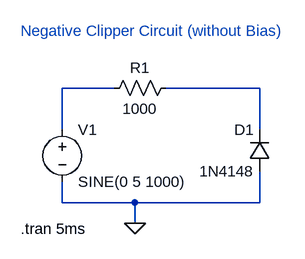
[diagram p0: schematic Assignment 1b (i).asc]
Assignment 1b (i).asc, the LTspice schematic file:
Version 4.1
SHEET 1 880 680
WIRE 176 64 96 64
WIRE 400 64 256 64
WIRE 96 128 96 64
WIRE 400 128 400 64
WIRE 96 240 96 208
WIRE 208 240 96 240
WIRE 400 240 400 192
WIRE 400 240 208 240
WIRE 208 272 208 240
FLAG 208 272 0
SYMBOL voltage 96 112 R0
WINDOW 123 0 0 Left 0
WINDOW 39 0 0 Left 0
SYMATTR InstName V1
SYMATTR Value SINE(0 5 1000)
SYMBOL res 272 48 R90
WINDOW 0 0 56 VBottom 2
WINDOW 3 32 56 VTop 2
SYMATTR InstName R1
SYMATTR Value 1000
SYMBOL diode 416 192 R180
WINDOW 0 24 64 Left 2
WINDOW 3 24 0 Left 2
SYMATTR InstName D1
SYMATTR Value 1N4148
TEXT 32 280 Left 2 !.tran 5ms
TEXT 32 -24 Left 2 ;Negative Clipper Circuit (without Bias)

The netlist it stands for:
* Assignment 1b (i).asc
V1 N001 0 SINE(0 5 1000)
R1 N002 N001 1000
D1 0 N002 1N4148
.model D D
.lib standard.dio
.tran 5ms
* Negative Clipper Circuit (without Bias)
.backanno
.end